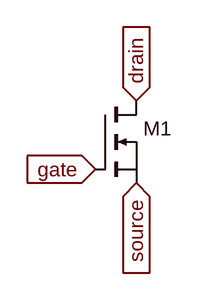
[diagram p0: schematic Draft3.asc]
Draft3.asc, the LTspice schematic file:
Version 4.1
SHEET 1 880 680
FLAG 240 112 drain
IOPIN 240 112 In
FLAG 240 208 source
IOPIN 240 208 In
FLAG 192 192 gate
IOPIN 192 192 In
SYMBOL nmos 192 112 R0
SYMATTR InstName M1
SYMATTR Value ""

The netlist it stands for:
* Draft3.asc
M1 drain gate source source
.model NMOS NMOS
.model PMOS PMOS
.lib standard.mos
.backanno
.end